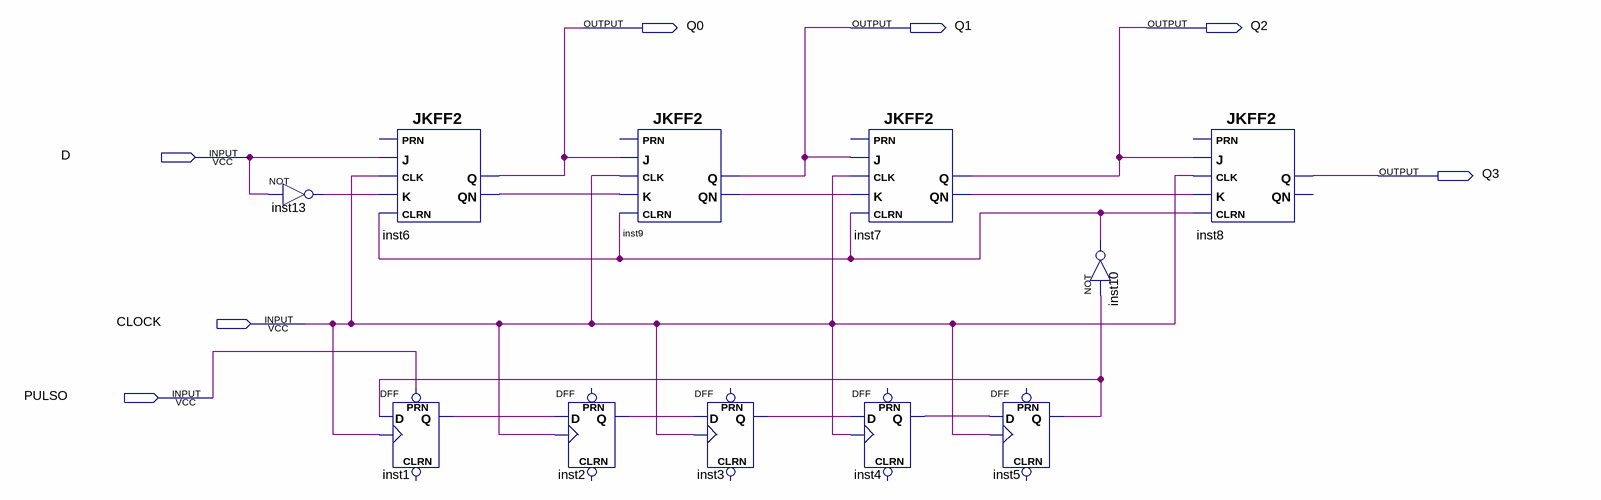
[diagram p0: schematic sheet]
// Quartus schematic ex4.bdf as structural Verilog: 11 symbols, 7 pins
module ex4 (
  input  D,
  input  CLOCK,
  input  PULSO,
  output Q0,
  output Q1,
  output Q2,
  output Q3
);

  wire inst1_q, inst2_q, inst3_q, inst4_q, inst5_q, inst6_qn, inst7_qn, inst9_qn, inst10_out, inst13_out;

  not inst13 (inst13_out, D);
  JKFF2 inst6 (.K(inst13_out), .CLRN(inst10_out), .CLK(CLOCK), .J(D), .QN(inst6_qn), .Q(Q0));  // open: PRN
  DFF inst1 (.CLK(CLOCK), .D(inst5_q), .PRN(PULSO), .Q(inst1_q));  // open: CLRN
  DFF inst2 (.CLK(CLOCK), .D(inst1_q), .Q(inst2_q));  // open: CLRN, PRN
  JKFF2 inst9 (.K(inst6_qn), .CLRN(inst10_out), .CLK(CLOCK), .J(Q0), .QN(inst9_qn), .Q(Q1));  // open: PRN
  DFF inst3 (.CLK(CLOCK), .D(inst2_q), .Q(inst3_q));  // open: CLRN, PRN
  JKFF2 inst7 (.K(inst9_qn), .CLRN(inst10_out), .CLK(CLOCK), .J(Q1), .QN(inst7_qn), .Q(Q2));  // open: PRN
  DFF inst4 (.CLK(CLOCK), .D(inst3_q), .Q(inst4_q));  // open: CLRN, PRN
  DFF inst5 (.CLK(CLOCK), .D(inst4_q), .Q(inst5_q));  // open: CLRN, PRN
  not inst10 (inst10_out, inst5_q);
  JKFF2 inst8 (.K(inst7_qn), .CLRN(inst10_out), .CLK(CLOCK), .J(Q2), .Q(Q3));  // open: PRN, QN
endmodule
